# Altium schematic sheet child2.SchDoc
size A3
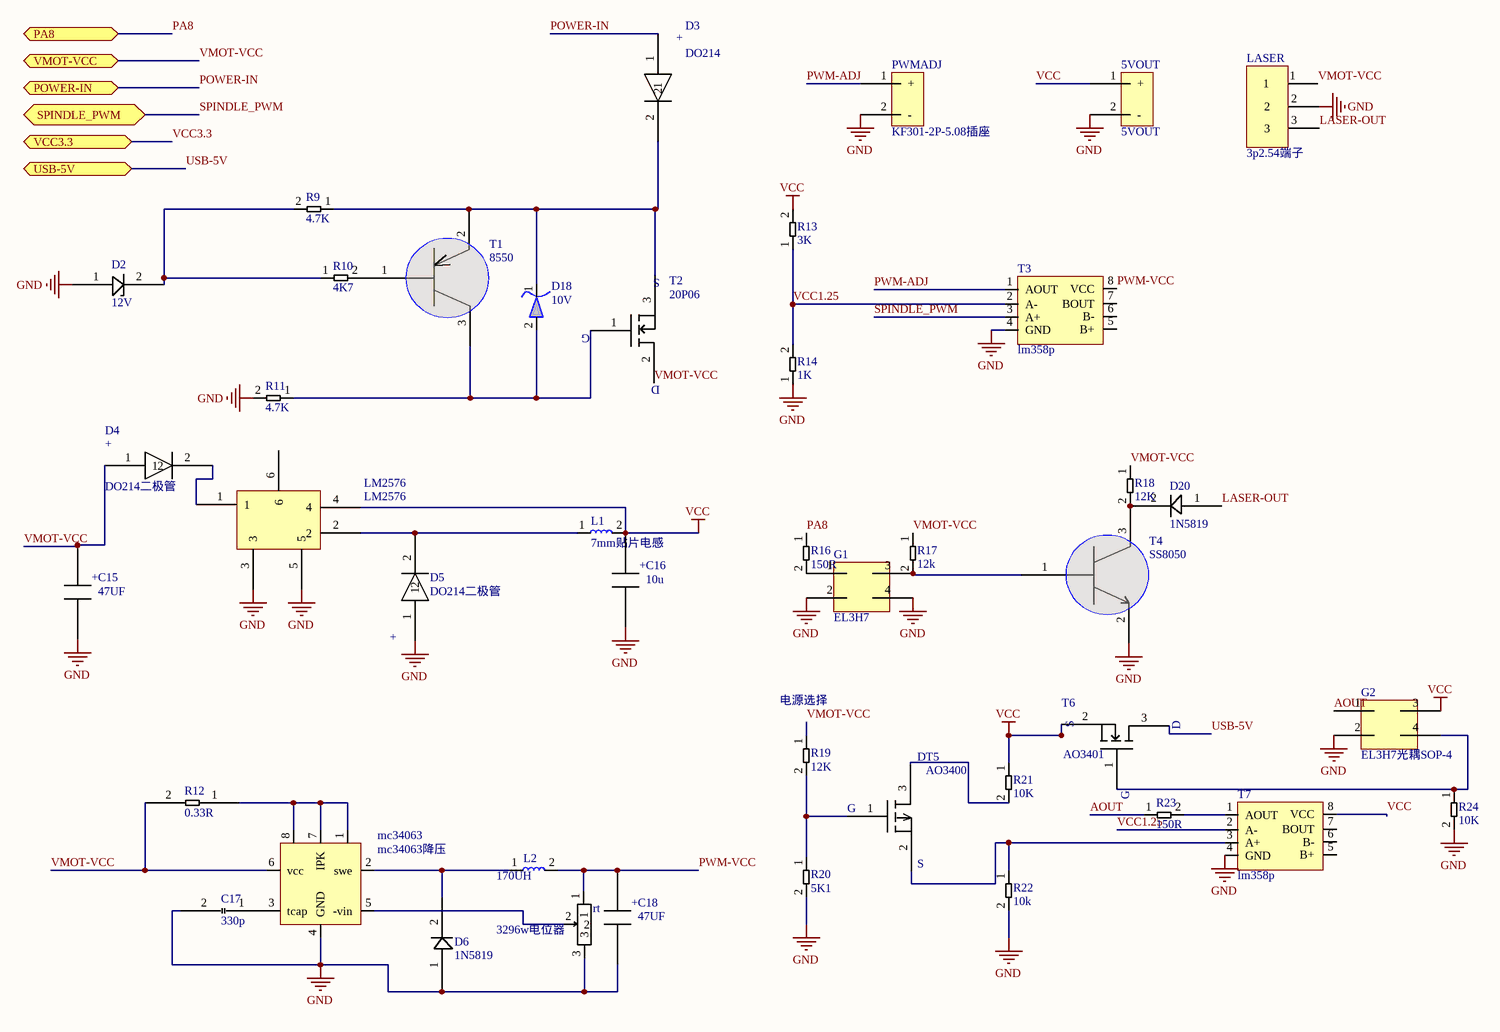
[diagram p0: child2.SchDoc]

## Parts
5VOUT  5VOUT  [KF301-2P-5.08插座]
C15  47UF  [10u电解电容]
C16  10u  [10u电解电容]
C17  330p  [0805电容]
C18  47UF  [10u电解电容]
D2  12V  [稳压二极管30v]
D3  DO214  [SMA封装二极管]
D4  DO214二极管  [SMA封装二极管]
D5  DO214二极管  [SMA封装二极管]
D6  1N5819  [0805-二极管]
D18  10V  [1/2w贴片稳压二极管]
D20  1N5819  [0805-二极管]
G1  EL3H7  [EL3H7SOP-4]
G2  EL3H7光耦SOP-4  [EL3H7SOP-4]
L1  7mm贴片电感  [7MM贴片电感]
L2  170UH  [7MM贴片电感]
LASER  3p2.54端子  [3p2.54端子]
LM2576  LM2576  [LM2576]
mc34063  mc34063降压  [SOP-8]
PWMADJ  KF301-2P-5.08插座  [KF301-2P-5.08插座]
R9  4.7K  [0805电阻]
R10  4K7  [0805电阻]
R11  4.7K  [0805电阻]
R12  0.33R  [0805电阻]
R13  3K  [0805电阻]
R14  1K  [0805电阻]
R16  150R  [0805电阻]
R17  12k  [0805电阻]
R18  12K  [0805电阻]
R19  12K  [0805电阻]
R20  5K1  [0805电阻]
R21  10K  [0805电阻]
R22  10k  [0805电阻]
R23  150R  [0805电阻]
R24  10K  [0805电阻]
rt  3296w电位器  [3296w电位器]
T1  8550  [SOT23]
T2  20P06  [to-252]
T3  lm358p  [SOP-8]
T4  SS8050  [SOT23]
T5  AO3400  [SOT23]
T6  AO3401  [SOT23]
T7  lm358p  [SOP-8]

## Ports
PA8 (bidir), POWER-IN (bidir), SPINDLE_PWM (bidir), USB-5V (bidir), VCC3.3 (bidir), VMOT-VCC (bidir)

## Nets
GND: 5VOUT.2(-) C15.2 C16.2 C17.2 C18.2 D2.1 D5.1 D6.1 G1.2 G1.4 G2.2 LASER.2 LM2576.3 LM2576.5 mc34063.4(GND) PWMADJ.2(-) R11.2 R14.1 R20.2 R22.2 R24.2 rt.3 T3.4(GND) T4.2 T7.4(GND)
VCC: 5VOUT.1(+) C16.1 G2.3 L1.2 LM2576.4 R13.2 R21.1 T6.2 T7.8(VCC)
AOUT: G2.1 R23.1
LASER-OUT: D20.1 LASER.3
PA8: R16.1 ; port PA8
POWER-IN: D3.1 ; port POWER-IN
PWM-ADJ: PWMADJ.1(+) T3.1(AOUT)
PWM-VCC: C18.1 L2.2 rt.1 T3.8(VCC)
SPINDLE_PWM: T3.3(A+) ; port SPINDLE_PWM
USB-5V: T6.3 ; port USB-5V
VCC1.25: R13.1 R14.2 T3.2(A-) T7.2(A-)
VCC3.3: port VCC3.3
VMOT-VCC: C15.1 D4.1 LASER.1 mc34063.6(vcc) R12.2 R17.1 R18.1 R19.1 T2.2 ; port VMOT-VCC
NetC17_1: C17.1 mc34063.3(tcap)
NetD2_2: D2.2 R9.2 R10.1
NetD3_2: D3.2 D18.1 R9.1 T1.2 T2.3
NetD4_2: D4.2 LM2576.1
NetD5_2: D5.2 L1.1 LM2576.2
NetD6_2: D6.2 L2.1 mc34063.2(swe)
NetD18_2: D18.2 R11.1 T1.3 T2.1
NetD20_2: D20.2 R18.2 T4.3
NetG1_1: G1.1 R16.2
NetG1_3: G1.3 R17.2 T4.1
NetG2_4: G2.4 R24.1 T6.1
Netmc34063_1: mc34063.1 mc34063.7(IPK) mc34063.8 R12.1
Netmc34063_5: mc34063.5(-vin) rt.2
NetR10_2: R10.2 T1.1
NetR19_2: R19.2 R20.1 T5.1
NetR21_2: R21.2 T5.3
NetR22_1: R22.1 T5.2 T7.3(A+)
NetR23_2: R23.2 T7.1(AOUT)

Not connected (* = marked no-connect by the designer): LM2576 6; T3 5(B+) 6(B-) 7(BOUT); T7 5(B+) 6(B-) 7(BOUT)

## Notes on the sheet
- (near R19) 电源选择
- Title
- Size:
- Date:
- A3
- Number:
- Time:
- Revision:
- Sheet
- of
- File:
- (in symbol 10u电解电容) +
- (in symbol 20P06场效应管) S; G; D
- (in symbol AO3400) D; G; S
- (in symbol AO3401) S; D; G
- (in symbol DO214二极管) +

## Library data of the parts
5VOUT = KF301-2P-5.08插座
C15 C16 C18 = 10u电解电容
C17 = 0805贴片电容
D2 = 稳压二极管
D3 = DO214二极管
D6 D20 = 0805二极管
D18 = 贴片稳压二极管
G1 = EL3H7光耦SOP-4
L2 = 7mm贴片电感
R9-R14 R16-R24 = 0805贴片电阻
T1 = ss8550三极管
T2 = 20P06场效应管